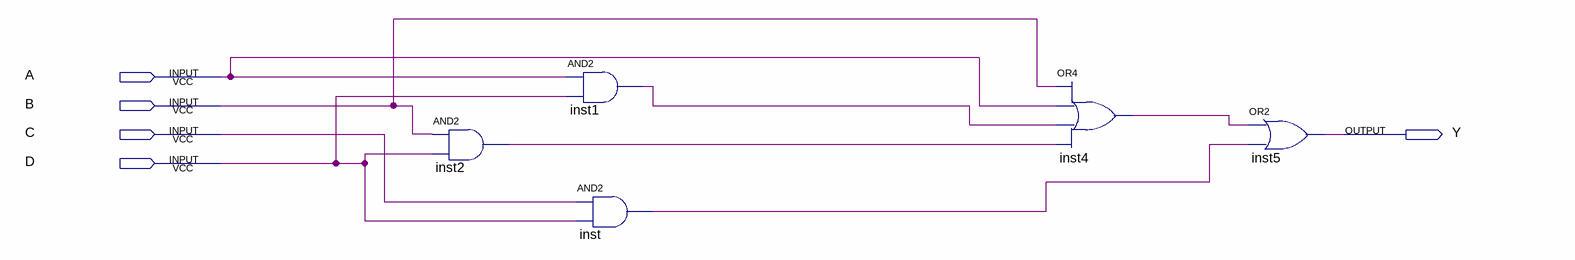
[diagram p0: schematic sheet]
// Quartus schematic practica1.bdf as structural Verilog: 5 symbols, 5 pins
module practica1 (
  input  A,
  input  B,
  input  C,
  input  D,
  output Y
);

  wire inst1_out, inst2_out, inst4_out, inst_out;

  and inst2 (inst2_out, B, D);
  and inst1 (inst1_out, A, D);
  and inst (inst_out, C, D);
  or inst4 (inst4_out, B, A, inst1_out, inst2_out);
  or inst5 (Y, inst4_out, inst_out);
endmodule
